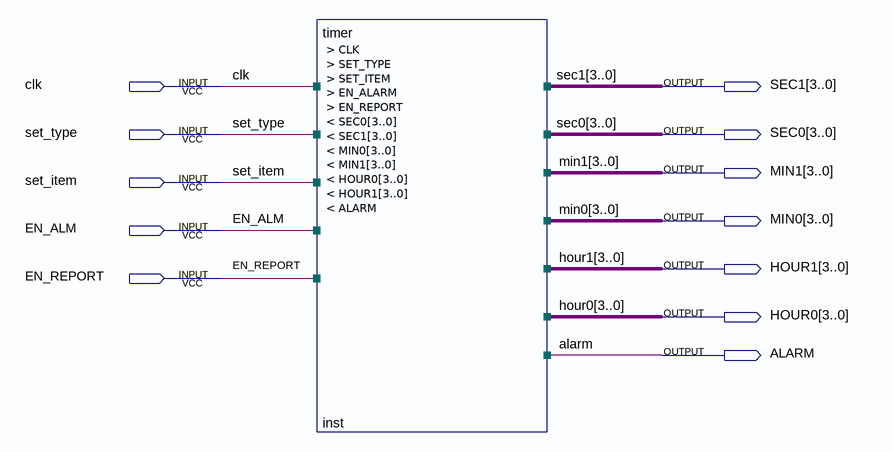
[diagram p0: schematic sheet]
// Quartus schematic timer_VHDL.bdf as structural Verilog: 1 symbols, 12 pins
module timer_VHDL (
  input  clk,
  input  set_type,
  input  set_item,
  input  EN_ALM,
  input  EN_REPORT,
  output [3:0] SEC1,
  output [3:0] SEC0,
  output [3:0] MIN1,
  output [3:0] MIN0,
  output [3:0] HOUR1,
  output [3:0] HOUR0,
  output ALARM
);

  timer inst (
    .CLK(clk), .SET_TYPE(set_type), .SET_ITEM(set_item), .EN_ALARM(EN_ALM), .EN_REPORT(EN_REPORT),
    .SEC0(SEC0), .SEC1(SEC1), .MIN0(MIN0), .MIN1(MIN1), .HOUR0(HOUR0), .HOUR1(HOUR1), .ALARM(ALARM));
endmodule
